# EAGLE design dip_hat_trick (EAGLE 6.5.0)
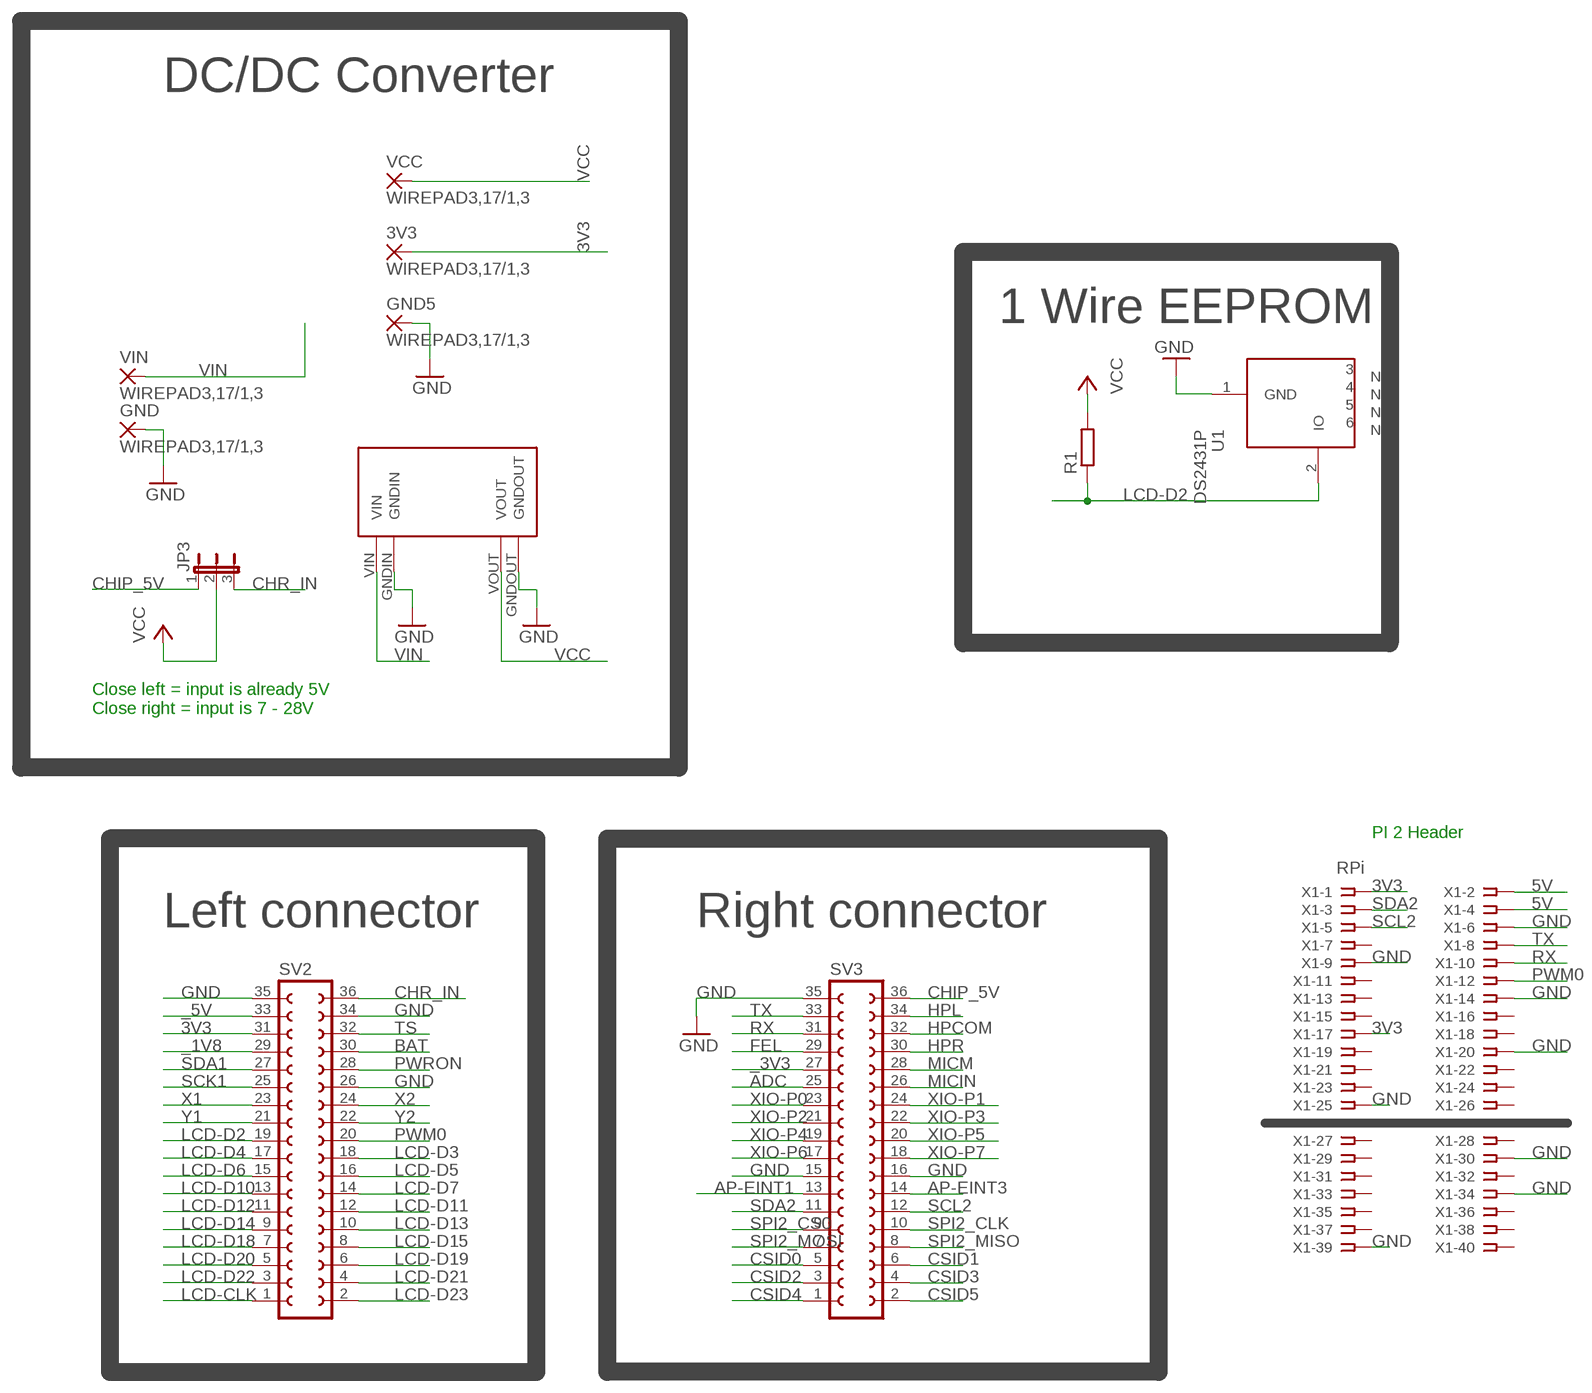
[diagram p0: schematic, sheet 1]

## Parts
3V3  WIREPAD3,17/1,3  [3,17/1,3]
GND  WIREPAD3,17/1,3  [3,17/1,3]
GND5  WIREPAD3,17/1,3  [3,17/1,3]
JP3  JP2E  [JP2]
R1  R-EU_R0805  [R0805]
SV2  FE18-2  [FE18-2]
SV3  FE18-2  [FE18-2]
U1  DS2431P  [TSOC6]
U$9  MP1584EN_FRAMELESS  [MP1584EN_FRAMELESS]
VCC  WIREPAD3,17/1,3  [3,17/1,3]
VIN  WIREPAD3,17/1,3  [3,17/1,3]
X1  RPi  SSW-120-02-S-D  [SSW-120-02-S-D]

## Nets
3V3: 3V3.1(P) SV2.31 X1.1 X1.17
5V: X1.2 X1.4
_1V8: SV2.29
_3V3: SV3.27
_5V: SV2.33
ADC: SV3.25
AP-EINT1: SV3.13
AP-EINT3: SV3.14
BAT: SV2.30
CHIP_5V: JP3.1 SV3.36
CHR_IN: JP3.3 SV2.36
CSID0: SV3.5
CSID1: SV3.6
CSID2: SV3.3
CSID3: SV3.4
CSID4: SV3.1
CSID5: SV3.2
FEL: SV3.29
GND: GND5.1(P) GND.1(P) SV2.26 SV2.34 SV2.35 SV3.15 SV3.16 SV3.35 U1.1(GND) U$9.GNDIN U$9.GNDOUT X1.6 X1.9 X1.14 X1.20 X1.25 X1.30 X1.34 X1.39
HPCOM: SV3.32
HPL: SV3.34
HPR: SV3.30
LCD-CLK: SV2.1
LCD-D2: R1.1 SV2.19 U1.2(IO)
LCD-D3: SV2.18
LCD-D4: SV2.17
LCD-D5: SV2.16
LCD-D6: SV2.15
LCD-D7: SV2.14
LCD-D10: SV2.13
LCD-D11: SV2.12
LCD-D12: SV2.11
LCD-D13: SV2.10
LCD-D14: SV2.9
LCD-D15: SV2.8
LCD-D18: SV2.7
LCD-D19: SV2.6
LCD-D20: SV2.5
LCD-D21: SV2.4
LCD-D22: SV2.3
LCD-D23: SV2.2
MICIN: SV3.26
MICM: SV3.28
PWM0: SV2.20 X1.12
PWRON: SV2.28
RX: SV3.31 X1.10
SCK1: SV2.25
SCL2: SV3.12 X1.5
SDA1: SV2.27
SDA2: SV3.11 X1.3
SPI2_CLK: SV3.10
SPI2_CS0: SV3.9
SPI2_MISO: SV3.8
SPI2_MOSI: SV3.7
TS: SV2.32
TX: SV3.33 X1.8
VCC: JP3.2 R1.2 U$9.VOUT VCC.1(P)
VIN: U$9.VIN VIN.1(P)
X1: SV2.23
X2: SV2.24
XIO-P0: SV3.23
XIO-P1: SV3.24
XIO-P2: SV3.21
XIO-P3: SV3.22
XIO-P4: SV3.19
XIO-P5: SV3.20
XIO-P6: SV3.17
XIO-P7: SV3.18
Y1: SV2.21
Y2: SV2.22
Unconnected: U1.3(NC) U1.4(NC) U1.5(NC) U1.6(NC) X1.7 X1.11 X1.13 X1.15 X1.16 X1.18 X1.19 X1.21 X1.22 X1.23 X1.24 X1.26 X1.27 X1.28 X1.29 X1.31 X1.32 X1.33 X1.35 X1.36 X1.37 X1.38 X1.40

## Notes on the sheet
- DC/DC Converter
- 1 Wire EEPROM
- Close left = input is already 5V
  Close right = input is 7 - 28V
- PI 2 Header
- Left connector | Right connector

## Library data of the parts
3V3 GND GND5 VCC VIN = wirepad:WIREPAD: Wire PAD connect wire on PCB
JP3 = jumper:JP2E: JUMPER
R1 = rcl:R-EU_: RESISTOR, European symbol
SV2 SV3 = con-lsta:FE18-2: FEMALE HEADER; OC_FARNELL: unknown; OC_NEWARK: unknown
U1 = JKW_CHIP:DS2431: 1024-Bit EEPROM This chip provides a 4x256 Bit EEPROM, which can be programmed@5V. Write protection and OTP emulation are available, too. Author: Jan Kandziora <jjj@gmx.de>; DESCRIPTION: IC, 1024-Bit, 1-Wire EEPROM, TSOC6; FOOTPRINT: TSOC6; LINK: http://www.digikey.com/product-detail/en/DS2431P%2BT%26R/DS2431P%2BT%26RCT-ND/3647900; MFG: DIGIKEY; MFG_PN: DS2431P+T&RCT-ND; PART_TYPE: IC; PRICE: 0.98; VENDOR: MAXIM; VENDOR_PART_NUMBER: DS2431P+T&R
U$9 = power_supply:MP1584EN_FRAMELESS
X1 = con-samtec:SSW-120-02-S-D: THROUGH-HOLE .025" SQ POST SOCKET Source: Samtec SSW.pdf; MPN: SSW-120-02-S-D; OC_FARNELL: unknown; OC_NEWARK: 11P9639

## Board
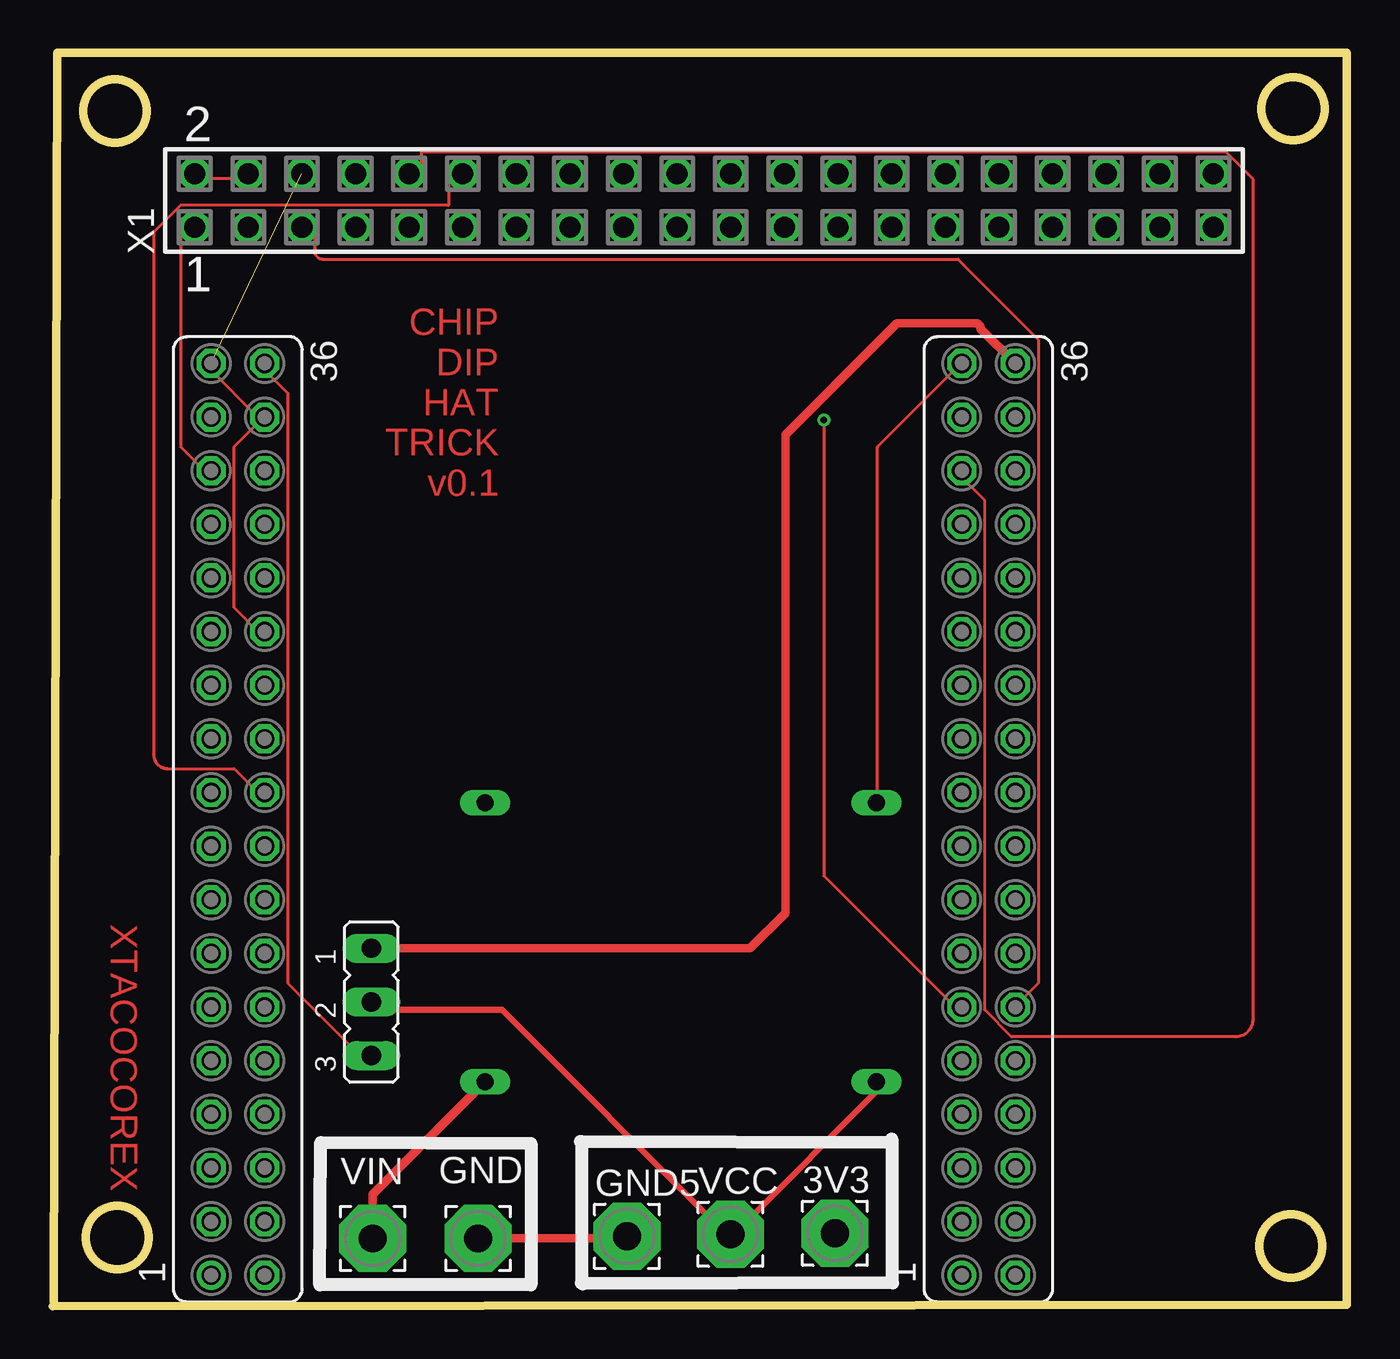
[diagram p1: board, top side]
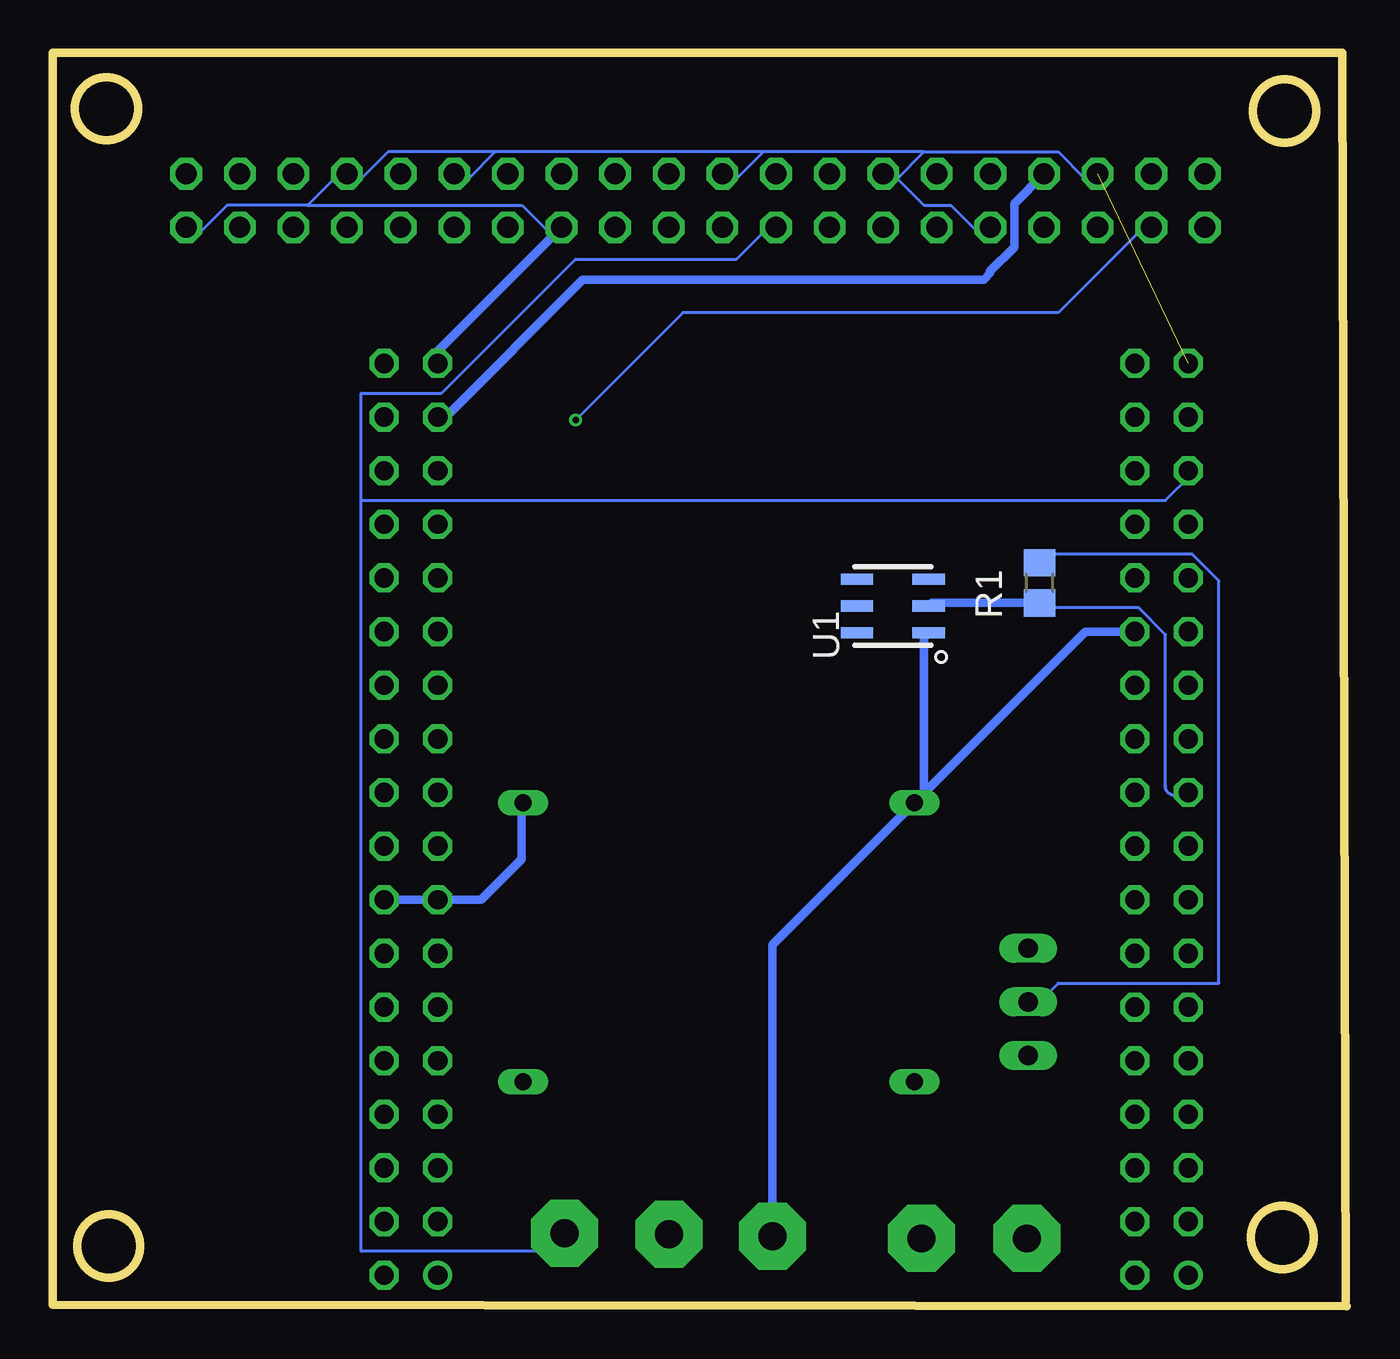
[diagram p2: board, bottom side, seen from below]

Size 61.3 x 59.35 mm. Coordinates in mm from the lower left corner, seen from the top.
Outline: 0.05,0.2 0.2,59.35 61.3,59.35 61.3,0.05 0,0
Outline: circle at 58.65,2.85 radius 1.49
Outline: circle at 3.05,3.25 radius 1.49
Outline: circle at 2.95,56.6 radius 1.49
Outline: circle at 58.75,56.7 radius 1.49
Copper layers (1*16): Top 0.035mm / dielectric 1.6mm / Bottom 0.035mm
Design rules "Elecrow_2-layer_PCB_eagle_rule": minimum track width 6mil, minimum drill 12mil, track to track 6mil, track to pad 6mil, pad to pad 6mil, via to via 8mil, smd to smd 0mil, copper to edge 20mil, drill to drill 10mil, minimum pad ring 6mil, minimum via ring 6mil, stop-mask expansion 0mil, vias tented up to drill 100mil, thermal gap 10mil

### Footprints (pad centres in the part's own frame; a part is rotated, then mirrored left to right if it is on the bottom)
3,17/1,3 = drill 1.321 pad 3.175 octagon: 1 0,0
JP2 = drill 0.914 long: 1 -2.54,0; 2 0,0; 3 2.54,0
R0805 = smd 1.3 x 1.5: 1 -0.95,0; 2 0.95,0
FE18-2 = drill 0.914: 1 -21.59,1.27 | drill 0.914 octagon: 2 -21.59,-1.27; 3 -19.05,1.27; 4 -19.05,-1.27; 5 -16.51,1.27; 6 -16.51,-1.27; 7 -13.97,1.27; 8 -13.97,-1.27; 9 -11.43,1.27; 10 -11.43,-1.27; 11 -8.89,1.27; 12 -8.89,-1.27; 13 -6.35,1.27; 14 -6.35,-1.27; 15 -3.81,1.27; 16 -3.81,-1.27; 17 -1.27,1.27; 18 -1.27,-1.27; 19 1.27,1.27; 20 1.27,-1.27; 21 3.81,1.27; 22 3.81,-1.27; 23 6.35,1.27; 24 6.35,-1.27; 25 8.89,1.27; 26 8.89,-1.27; 27 11.43,1.27; 28 11.43,-1.27; 29 13.97,1.27; 30 13.97,-1.27; 31 16.51,1.27; 32 16.51,-1.27; 33 19.05,1.27; 34 19.05,-1.27; 35 21.59,1.27; 36 21.59,-1.27
TSOC6 = smd 0.53 x 1.53: 1 -1.27,-1.7; 2 0,-1.7; 3 1.27,-1.7; 4 1.27,1.7; 5 0,1.7; 6 -1.27,1.7
MP1584EN_FRAMELESS = drill 0.8 long: GNDIN 1.778,14.986; GNDOUT 20.32,14.986; VIN 1.778,1.778; VOUT 20.32,1.778
SSW-120-02-S-D = drill 1 pad 1.5 octagon: 1 -24.13,-1.27; 2 -24.13,1.27; 3 -21.59,-1.27; 4 -21.59,1.27; 5 -19.05,-1.27; 6 -19.05,1.27; 7 -16.51,-1.27; 8 -16.51,1.27; 9 -13.97,-1.27; 10 -13.97,1.27; 11 -11.43,-1.27; 12 -11.43,1.27; 13 -8.89,-1.27; 14 -8.89,1.27; 15 -6.35,-1.27; 16 -6.35,1.27; 17 -3.81,-1.27; 18 -3.81,1.27; 19 -1.27,-1.27; 20 -1.27,1.27; 21 1.27,-1.27; 22 1.27,1.27; 23 3.81,-1.27; 24 3.81,1.27; 25 6.35,-1.27; 26 6.35,1.27; 27 8.89,-1.27; 28 8.89,1.27; 29 11.43,-1.27; 30 11.43,1.27; 31 13.97,-1.27; 32 13.97,1.27; 33 16.51,-1.27; 34 16.51,1.27; 35 19.05,-1.27; 36 19.05,1.27; 37 21.59,-1.27; 38 21.59,1.27; 39 24.13,-1.27; 40 24.13,1.27

### Placement (x,y rotation side)
3V3  37.05,3.45 0 top
GND  20.15,3.2 0 top
GND5  27.2,3.3 0 top
JP3  15.1,14.4 270 top
R1  14.55,34.25 90 bottom
SV2  8.77,23.05 90 top
SV3  44.33,23.05 90 top
U1  21.5,33.15 90 bottom
U$9  18.7,8.85 0 top
VCC  32.1,3.4 0 top
VIN  15.15,3.2 0 top
X1  30.85,52.35 0 top

### Tracks (layer width: path | path; a pad name or v marks a point on that pad's centre or on a via)
3V3
  Top 0.152: SV2.31 7.32,39.42 6.05,40.69 6.05,50.85 X1.1
  Bottom 0.152: 46.69,38.15 46.69,2.59 37.8,2.59 3V3.1 | 46.69,38.15 46.69,43.23 42.88,43.23 36.53,49.58 28.91,49.58 27.64,50.85 X1.17 | 46.69,38.15 8.59,38.15 7.32,39.42 SV2.31
5V
  Top 0.152: X1.2 7.32,53.39 8.59,53.39 X1.4
CHIP_5V
  Top 0.406: JP3.1 33.04,16.94 34.7,18.6 34.7,41.25 40,46.55 43.8,46.55 43.95,46.4 43.95,46.29 SV3.36
CHR_IN
  Top 0.152: JP3.3 14.94,11.48 11.13,15.29 11.13,43.23 9.86,44.5 SV2.36
GND  (1 unrouted)
  Top 0.152: 9.86,41.96 7.32,44.5 SV2.35 | 9.86,41.96 8.59,40.69 8.59,33.07 9.86,31.8 SV2.26 | 9.86,41.96 SV2.34 | SV3.35 42.88,44.5 39.07,40.69 39.07,24.18 U$9.GNDOUT
  Top 0.406: SV2.34 10.16,42.22 | GND.1 27.1,3.2 GND5.1
  Bottom 0.152: 20.02,54.66 13.67,54.66 12.4,53.39 X1.6 | 21.29,53.39 20.02,54.66 | 21.29,53.39 20.02,52.12 18.75,52.12 17.48,50.85 X1.9 | 21.29,53.39 X1.14 | 27.64,54.66 28.91,53.39 X1.20 | 20.02,54.66 27.64,54.66 | 40.34,54.66 41.61,53.39 X1.30 | 27.64,54.66 40.34,54.66 | 40.34,54.66 45.42,54.66 46.69,53.39 X1.34 47.96,53.39 49.23,52.12 | 49.23,52.12 53.04,52.12 54.31,50.85 X1.39 | 49.23,52.12 39.07,52.12 37.8,50.85 X1.25 | 39.07,21.64 39.1,21.64 | 26.37,17.83 26.43,17.89 | 20.02,24.18 U$9.GNDIN
  Bottom 0.406: GND5.1 27.2,17.11 26.43,17.89 U$9.GNDIN 12.37,31.94 SV2.26 | SV3.16 SV3.15 41.01,19.24 39.1,21.15 39.1,21.64 39.1,23.76 U$9.GNDOUT | SV3.35 43.06,45.22 X1.25 | 20.02,24.18 20.02,31.66 U1.1
LCD-D2
  Bottom 0.152: R1.1 14.94,33.07 9.86,33.07 8.59,31.8 8.59,24.62 arc-90 8.15,24.18 7.32,24.18 SV2.19
  Bottom 0.406: R1.1 19.65,33.3 U1.2
LCD-D3
  Top 0.406: 10.16,21.9 SV2.18
PWM0
  Top 0.152: SV2.20 9.86,24.18 8.59,25.45 5.44,25.45 arc-90 4.78,26.11 4.78,50.85 6.05,52.12 18.75,52.12 18.75,53.39 X1.12
RX
  Top 0.152: SV3.31 42.88,39.42 44.15,38.15 44.15,14.02 45.42,12.75 56.04,12.75 arc90 56.85,13.56 56.85,53.39 55.58,54.66 17.48,54.66 17.48,53.39 X1.10
SCL2
  Top 0.152: SV3.12 45.42,14.02 46.69,15.29 46.69,45.77 42.88,49.58 12.79,49.58 arc-90 12.4,49.97 12.4,50.85 X1.5
SDA2  (via drill 0.3)
  Top 0.152: v36.53,41.96 36.53,20.37 42.88,14.02 SV3.11
  Bottom 0.152: v36.53,41.96 31.45,47.04 13.67,47.04 9.86,50.85 X1.3
TX
  Bottom 0.406: SV3.33 42.7,42.1 36.2,48.6 17.2,48.6 16.9,48.9 16.9,49 15.75,50.15 15.75,52.21 X1.8
VCC
  Top 0.152: 39.07,10.21 U$9.VOUT | 32.72,3.86 VCC.1 31.45,3.86 | 16.21,14.02 JP3.2
  Top 0.305: 32.72,3.86 39.07,10.21 | 31.45,3.86 21.29,14.02 16.21,14.02
  Bottom 0.152: R1.2 14.94,35.61 7.32,35.61 6.05,34.34 6.05,15.29 13.67,15.29 14.94,14.02 JP3.2
VIN
  Top 0.406: VIN.1 15.15,5.3 U$9.VIN

### Text on the board
Top: CHIP / DIP / HAT / TRICK / v0.1 | XTACOCOREX